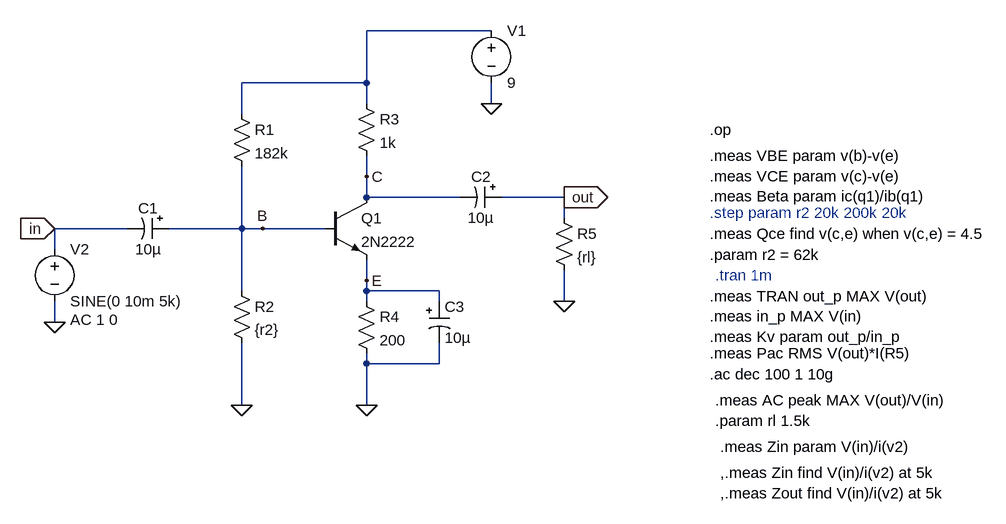
[diagram p0: schematic phân tích thông số dc ac.asc]
phân tích thông số dc ac.asc, the LTspice schematic file:
Version 4
SHEET 1 1320 680
WIRE 512 -64 320 -64
WIRE 320 16 320 -64
WIRE 320 16 128 16
WIRE 320 48 320 16
WIRE 512 48 512 16
WIRE 128 64 128 16
WIRE 320 160 320 128
WIRE 320 192 320 160
WIRE 464 192 320 192
WIRE 624 192 528 192
WIRE 624 224 624 192
WIRE -48 240 -160 240
WIRE 128 240 128 144
WIRE 128 240 16 240
WIRE 160 240 128 240
WIRE 256 240 160 240
WIRE -160 272 -160 240
WIRE 320 320 320 288
WIRE 128 336 128 240
WIRE 320 336 320 320
WIRE 432 336 320 336
WIRE 320 352 320 336
WIRE 432 352 432 336
WIRE 624 352 624 304
WIRE -160 384 -160 352
WIRE 320 448 320 432
WIRE 432 448 432 416
WIRE 432 448 320 448
WIRE 128 512 128 416
WIRE 320 512 320 448
FLAG 512 48 0
FLAG -160 384 0
FLAG 128 512 0
FLAG 320 512 0
FLAG 624 352 0
FLAG -160 240 in
IOPIN -160 240 In
FLAG 624 192 out
IOPIN 624 192 Out
FLAG 160 240 B
FLAG 320 160 C
FLAG 320 320 E
SYMBOL res 112 48 R0
SYMATTR InstName R1
SYMATTR Value 182k
SYMBOL res 112 320 R0
SYMATTR InstName R2
SYMATTR Value {r2}
SYMBOL res 304 32 R0
SYMATTR InstName R3
SYMATTR Value 1k
SYMBOL res 304 336 R0
SYMATTR InstName R4
SYMATTR Value 200
SYMBOL npn 256 192 R0
SYMATTR InstName Q1
SYMATTR Value 2N2222
SYMBOL voltage 512 -80 R0
WINDOW 123 0 0 Left 0
WINDOW 39 0 0 Left 0
SYMATTR InstName V1
SYMATTR Value 9
SYMBOL voltage -160 256 R0
WINDOW 123 24 124 Left 2
SYMATTR InstName V2
SYMATTR Value SINE(0 10m 5k)
SYMATTR Value2 AC 1 0
SYMATTR SpiceLine Rser=600
SYMBOL polcap 16 224 R90
WINDOW 0 0 32 VBottom 2
WINDOW 3 32 32 VTop 2
SYMATTR InstName C1
SYMATTR Value 10µ
SYMATTR Description Capacitor
SYMATTR Type cap
SYMATTR SpiceLine V=16 Irms=0 Rser=2.8 Lser=0 mfg="AVX" pn="TAJC106M016" type="Tantalum"
SYMBOL polcap 528 176 R90
WINDOW 0 0 32 VBottom 2
WINDOW 3 32 32 VTop 2
SYMATTR InstName C2
SYMATTR Value 10µ
SYMATTR Description Capacitor
SYMATTR Type cap
SYMATTR SpiceLine V=16 Irms=0 Rser=2.8 Lser=0 mfg="AVX" pn="TAJC106M016" type="Tantalum"
SYMBOL polcap 416 352 R0
WINDOW 3 24 56 Left 2
SYMATTR Value 10µ
SYMATTR InstName C3
SYMATTR Description Capacitor
SYMATTR Type cap
SYMATTR SpiceLine V=16 Irms=0 Rser=2.8 Lser=0 mfg="AVX" pn="TAJC106M016" type="Tantalum"
SYMBOL res 608 208 R0
SYMATTR InstName R5
SYMATTR Value {rl}
TEXT 848 88 Left 2 !.op
TEXT 848 128 Left 2 !.meas VBE param v(b)-v(e)\n.meas VCE param v(c)-v(e)\n.meas Beta param ic(q1)/ib(q1)
TEXT 848 216 Left 2 ;.step param r2 20k 200k 20k
TEXT 848 248 Left 2 !.meas Qce find v(c,e) when v(c,e) = 4.5
TEXT 848 280 Left 2 !.param r2 = 62k
TEXT 856 312 Left 2 ;.tran 1m
TEXT 848 344 Left 2 !.meas TRAN out_p MAX V(out)\n.meas in_p MAX V(in)\n.meas Kv param out_p/in_p
TEXT 848 432 Left 2 !.meas Pac RMS V(out)*I(R5)
TEXT 848 464 Left 2 !.ac dec 100 1 10g
TEXT 856 504 Left 2 !.meas AC peak MAX V(out)/V(in)
TEXT 856 536 Left 2 !.param rl 1.5k
TEXT 864 576 Left 2 !.meas Zin param V(in)/i(v2)
TEXT 864 616 Left 2 !,.meas Zin find V(in)/i(v2) at 5k\n,.meas Zout find V(in)/i(v2) at 5k

The netlist it stands for:
* phân tích thông số dc ac.asc
R1 N001 B 182k
R2 B 0 {r2}
R3 N001 C 1k
R4 E 0 200
Q1 C B E 0 2N2222
V1 N001 0 9
V2 in 0 SINE(0 10m 5k) AC 1 0 Rser=600
C1 B in 10µ V=16 Irms=0 Rser=2.8 Lser=0 mfg="AVX" pn="TAJC106M016" type="Tantalum"
C2 out C 10µ V=16 Irms=0 Rser=2.8 Lser=0 mfg="AVX" pn="TAJC106M016" type="Tantalum"
C3 E 0 10µ V=16 Irms=0 Rser=2.8 Lser=0 mfg="AVX" pn="TAJC106M016" type="Tantalum"
R5 out 0 {rl}
.model NPN NPN
.model PNP PNP
.lib standard.bjt
.op
.meas VBE param v(b)-v(e)
.meas VCE param v(c)-v(e)
.meas Beta param ic(q1)/ib(q1)
* .step param r2 20k 200k 20k
.meas Qce find v(c,e) when v(c,e) = 4.5
.param r2 = 62k
* .tran 1m
.meas TRAN out_p MAX V(out)
.meas in_p MAX V(in)
.meas Kv param out_p/in_p
.meas Pac RMS V(out)*I(R5)
.ac dec 100 1 10g
.meas AC peak MAX V(out)/V(in)
.param rl 1.5k
.meas Zin param V(in)/i(v2)
,.meas Zin find V(in)/i(v2) at 5k
,.meas Zout find V(in)/i(v2) at 5k
.backanno
.end